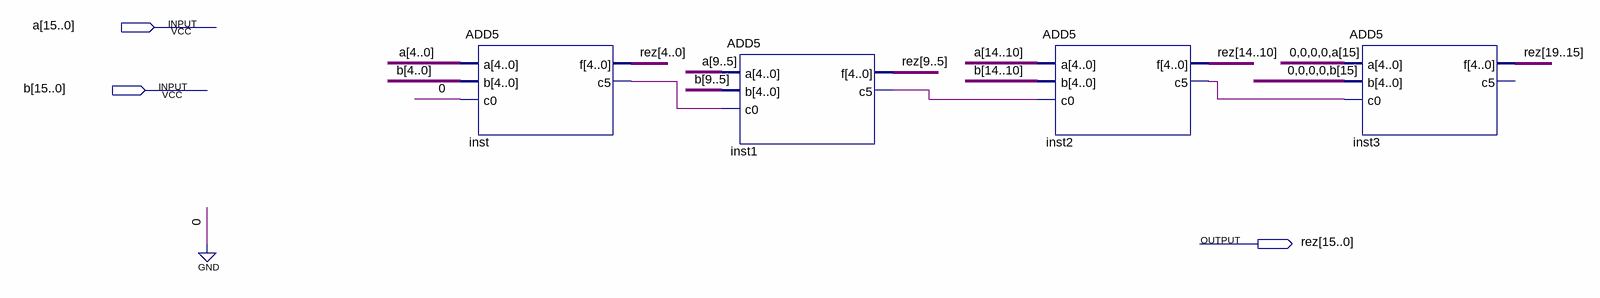
[diagram p0: schematic sheet]
// Quartus schematic add.bdf as structural Verilog: 4 symbols, 3 pins
module add (
  input  [15:0] a,
  input  [15:0] b,
  output [19:0] rez
);

  wire inst1_c5, inst2_c5, inst_c5;

  ADD5 inst (.a(a[4:0]), .b(b[4:0]), .c0(1'b0), .f(rez[4:0]), .c5(inst_c5));
  ADD5 inst1 (.a(a[9:5]), .b(b[9:5]), .c0(inst_c5), .f(rez[9:5]), .c5(inst1_c5));
  ADD5 inst2 (.a(a[14:10]), .b(b[14:10]), .c0(inst1_c5), .f(rez[14:10]), .c5(inst2_c5));
  ADD5 inst3 (.a({4'b0000, a[15]}), .b({4'b0000, b[15]}), .c0(inst2_c5), .f(rez[19:15]));  // open: c5
endmodule
